# EAGLE design Servorino_FT230X_brick_headers (EAGLE 9.6.2)
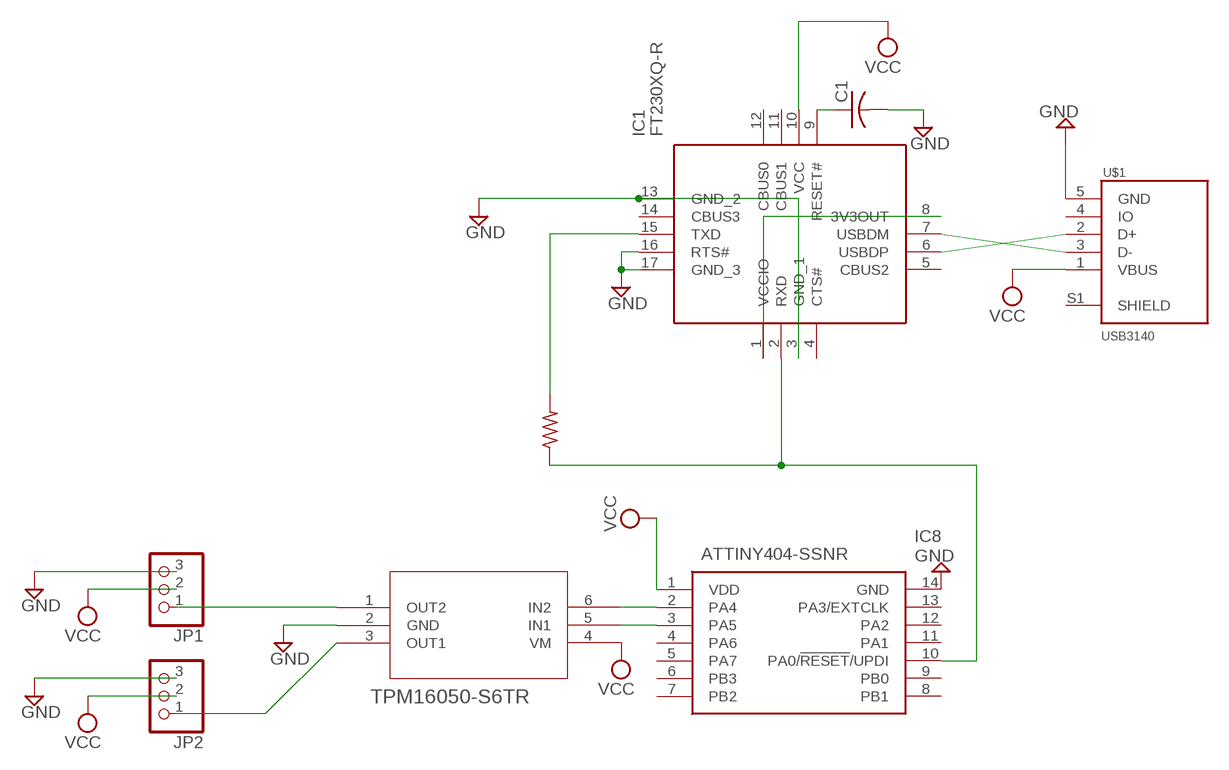
[diagram p0: schematic, sheet 1]

## Parts
C1  C-USC0603  [C0603]
IC1  FT230XQ-R  [QFN65P400X400X80-17N]
IC8  ATTINY404-SSNR  [SOIC127P600X175-14N]
JP1  PINHD-1X3  [1X03]
JP2  PINHD-1X3  [1X03]
R6  470  R-US_R0805  [R0805]
U1  TPM16050-S6TR  [SOT23-6_TPK]
U$1  USB3140  [USB3140-30-0170-0-C]

## Nets
GND: C1.2 IC1.3(GND_1) IC1.13(GND_2) IC1.16(RTS#) IC1.17(GND_3) IC8.14(GND) JP1.3 JP2.3 U1.2(GND) U$1.5(GND)
N$1: IC8.2(PA4) U1.6(IN2)
N$2: IC8.3(PA5) U1.5(IN1)
N$3: JP1.1 U1.1(OUT2)
N$4: JP2.1 U1.3(OUT1)
N$5: IC1.1(VCCIO) IC1.8(3V3OUT)
N$6: C1.1 IC1.9(RESET#)
N$7: IC1.7(USBDM) U$1.3(D-)
N$8: IC1.6(USBDP) U$1.2(D+)
N$11: IC1.15(TXD) R6.2
N$13: IC1.2(RXD) IC8.10(PA0/!RESET!/UPDI) R6.1
VCC: IC1.10(VCC) IC8.1(VDD) JP1.2 JP2.2 U1.4(VM) U$1.1(VBUS)
Unconnected: IC1.4(CTS#) IC1.5(CBUS2) IC1.11(CBUS1) IC1.12(CBUS0) IC1.14(CBUS3) IC8.4(PA6) IC8.5(PA7) IC8.6(PB3) IC8.7(PB2) IC8.8(PB1) IC8.9(PB0) IC8.11(PA1) IC8.12(PA2) IC8.13(PA3/EXTCLK) U$1.4(IO) U$1.S1(SHIELD)

## Library data of the parts
C1 = rcl:C-US: CAPACITOR, American symbol; SPICEPREFIX: C
IC1 = SamacSys_Parts:FT230XQ-R: X-Chip USB to Basic UART Interface FTDI Chip FT230XQ-R UART Interface 3MBd, 5 V, 16-Pin, QFN Source: Datasheet <https://componentsearchengine.com/Datasheets/1/FT230XQ-R.pdf>; DESCRIPTION: X-Chip USB to Basic UART Interface FTDI Chip FT230XQ-R UART Interface 3MBd, 5 V, 16-Pin, QFN; HEIGHT: 0.8mm; MANUFACTURER_NAME: FTDI Chip; MANUFACTURER_PART_NUMBER: FT230XQ-R; MOUSER_PART_NUMBER: 895-FT230XQ-R; MOUSER_PRICE-STOCK: https://www.mouser.co.uk/ProductDetail/FTDI/FT230XQ-R?qs=Gp1Yz1mis3VvmXwyDmIHOg%3D%3D
IC8 = SamacSys_Parts:ATTINY404-SSNR: MICROCHIP - ATTINY404-SSNR - MCU, 8BIT, 20MHZ, SOIC-14 Source: Datasheet <https://datasheet.datasheetarchive.com/originals/distributors/DKDS-39/8204.pdf>; DESCRIPTION: MICROCHIP - ATTINY404-SSNR - MCU, 8BIT, 20MHZ, SOIC-14; HEIGHT: 1.75mm; MANUFACTURER_NAME: Microchip; MANUFACTURER_PART_NUMBER: ATTINY404-SSNR; MOUSER_PART_NUMBER: 556-ATTINY404-SSNR; MOUSER_PRICE-STOCK: https://www.mouser.co.uk/ProductDetail/Microchip-Technology-Atmel/ATTINY404-SSNR?qs=F5EMLAvA7IAEqD7Aw0z%252B9Q%3D%3D
JP1 JP2 = pinhead:PINHD-1X3: PIN HEADER
R6 = adafruit:R-US_: RESISTOR, American symbol
U1 = brockology:TPM16050-S6TR; COPYRIGHT: Copyright (C) 2025 Ultra Librarian. All rights reserved.; MANUFACTURER_PART_NUMBER: TPM16050-S6TR; MFR_NAME: 3Peak
U$1 = USB:USB3140

## Board
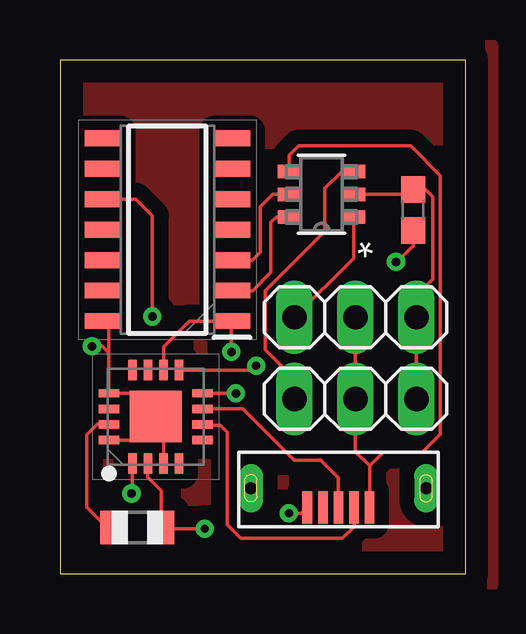
[diagram p1: board, top side]
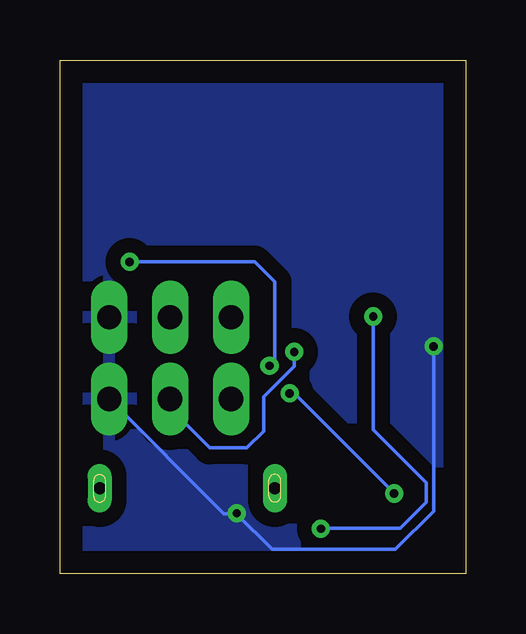
[diagram p2: board, bottom side, seen from below]

Size 16.9 x 21.4 mm. Coordinates in mm from the lower left corner, seen from the top.
Outline: 0,0 16.9,0 16.9,21.4 0,21.4 0,0
Copper layers (1*16): Top 0.035mm / dielectric 1.5mm / Bottom 0.035mm
Design rules "default *": minimum track width 6mil, minimum drill 0.35mm, track to track 6mil, track to pad 6mil, pad to pad 6mil, via to via 6mil, smd to smd 6mil, copper to edge 37mil, drill to drill 2mil, minimum pad ring 10mil, minimum via ring 8mil, stop-mask expansion 4mil, vias tented up to drill 0mil, thermal gap 10mil

### Footprints (pad centres in the part's own frame; a part is rotated, then mirrored left to right if it is on the bottom)
C0603 = smd 1.1 x 1: 1 -0.85,0; 2 0.85,0
QFN65P400X400X80-17N = smd 0.85 x 0.35: 1 -1.95,0.975; 2 -1.95,0.325; 3 -1.95,-0.325; 4 -1.95,-0.975; 9 1.95,-0.975; 10 1.95,-0.325; 11 1.95,0.325; 12 1.95,0.975 | smd 0.35 x 0.85: 5 -0.975,-1.95; 6 -0.325,-1.95; 7 0.325,-1.95; 8 0.975,-1.95; 13 0.975,1.95; 14 0.325,1.95; 15 -0.325,1.95; 16 -0.975,1.95 | smd 2.15 x 2.15: 17 0,0
SOIC127P600X175-14N = smd 1.5 x 0.65: 1 -2.7,3.81; 2 -2.7,2.54; 3 -2.7,1.27; 4 -2.7,0; 5 -2.7,-1.27; 6 -2.7,-2.54; 7 -2.7,-3.81; 8 2.7,-3.81; 9 2.7,-2.54; 10 2.7,-1.27; 11 2.7,0; 12 2.7,1.27; 13 2.7,2.54; 14 2.7,3.81
1X03 = drill 1.016 long: 1 -2.54,0; 2 0,0; 3 2.54,0
R0805 = smd 1.1 x 1.4: 1 -1,0; 2 1,0
SOT23-6_TPK = smd 0.978 x 0.559: 1 -1.34,0.95; 2 -1.34,0; 3 -1.34,-0.95; 4 1.34,-0.95; 5 1.34,0; 6 1.34,0.95
USB3140-30-0170-0-C = smd 0.4 x 1.35: 1 -1.3,0; 2 -0.65,0; 3 0,0; 4 0.65,0; 5 1.3,0 | drill 0.5 pad 0.775 long: S1 3.65,-0.8; S3 -3.65,-0.8

### Placement (x,y rotation side)
C1  14.72,15.15 90 top
IC1  3.99,6.54 90 top
IC8  4.47,14.33 180 top
JP1  12.31,10.68 0 top
JP2  12.31,7.28 0 top
R6  3.22,1.92 180 top
U1  10.9,15.8 180 top
U$1  11.6,2.76 180 top

### Tracks (layer width: path | path; a pad name or v marks a point on that pad's centre or on a via)
GND  (via drill 0.35)
  Top 0.152: 10.28,3.13 10.29,2.95 U$1.5 10.05,2.52 v9.54,2.52 | IC1.3 4.32,6.21 IC1.17 | IC1.17 3.02,7.51 IC1.13 2.04,9.2 | IC1.16 3.02,5.57 IC1.17 | IC8.14 2.04,10.25 2.04,9.2 | 2.04,9.2 1.74,9.5 1.14,9.5 1.17,9.47 v1.33,9.47 | JP2.3 JP1.3 14.85,11.59 15.53,12.27 15.53,15.7 15.23,16 C1.2 14.52,15.8 U1.2
  Bottom 0.152: v1.33,9.47 1.33,2.61 2.93,1.01 8.06,1.01 9.55,2.5 | 9.55,2.5 v9.54,2.52 | JP2.3 10.07,2.5 9.55,2.5
  pour Bottom (isolate 0.61): -1,22.5 19,22.5 19,-1 -1,-1
N$1
  Top 0.152: IC8.2 8.03,11.79 8.79,12.55 8.79,14.64 9,14.85 U1.6
N$2
  Top 0.152: IC8.3 8.02,13.06 8.34,13.38 8.34,15.28 8.86,15.8 U1.5
N$3
  Top 0.152: U1.1 12.24,13.15 JP1.1
N$4
  Top 0.152: JP2.1 9.77,8.12 8.56,9.33 8.56,11.78 11.04,14.26 11.04,16.05 11.74,16.75 U1.3
N$5  (via drill 0.35)
  Top 0.152: IC1.1 3.02,3.35 v2.99,3.33 v2.98,3.34 | v7.33,7.51 IC1.8
  Bottom 0.152: v2.98,3.34 7.17,7.53 7.33,7.53 v7.33,7.51
N$6  (via drill 0.35)
  Top 0.152: C1.1 14.72,13.66 14.05,12.99 v14,12.99 | v8.17,8.66 7.98,8.47 4.99,8.47 IC1.9
  Bottom 0.152: v14,12.99 8.79,12.99 7.95,12.15 7.95,8.66 v8.17,8.66
N$7
  Top 0.152: IC1.7 7.62,6.87 9.75,4.73 10.84,4.73 10.85,4.74 11.6,3.99 U$1.3
N$8
  Top 0.152: IC1.6 5.97,6.18 6.67,6.18 6.97,5.88 6.97,2.03 7.53,1.47 11.77,1.47 12.25,1.95 U$1.2
N$11
  Top 0.152: R6.2 1.96,1.92 1.12,2.76 1.12,5.79 1.54,6.21 IC1.15
N$13  (via drill 0.35)
  Top 0.152: IC1.2 3.67,4.01 4.22,3.46 R6.1 4.27,1.87 v6.03,1.87 | v3.85,10.71 3.85,14.9 3.15,15.6 IC8.10
  Bottom 0.152: v3.85,10.71 3.85,5.99 1.65,3.79 1.65,2.97 2.72,1.9 6,1.9 v6.03,1.87
TOPSIGNAL
  pour Top (isolate 0.61): -0.5,22 18,22 18,-0.5 -0.5,-0.5
VCC  (via drill 0.35)
  Top 0.152: IC1.10 4.32,9.46 5.38,10.52 IC8.1 7.14,10.48 v7.14,9.24 | U$1.1 12.9,4.49 | 12.9,4.49 12.31,5.08 JP2.2 JP1.2 | U1.4 9.56,17.44 9.94,17.82 14.61,17.82 15.85,16.58 15.85,5.81 15.09,5.05 13.46,5.05 12.9,4.49
  Bottom 0.152: v7.14,9.24 7.14,8.64 8.42,7.36 8.42,5.93 9.11,5.24 10.67,5.24 12.31,6.88 JP2.2